# EAGLE design barebonesarduino (EAGLE 7.5.0)
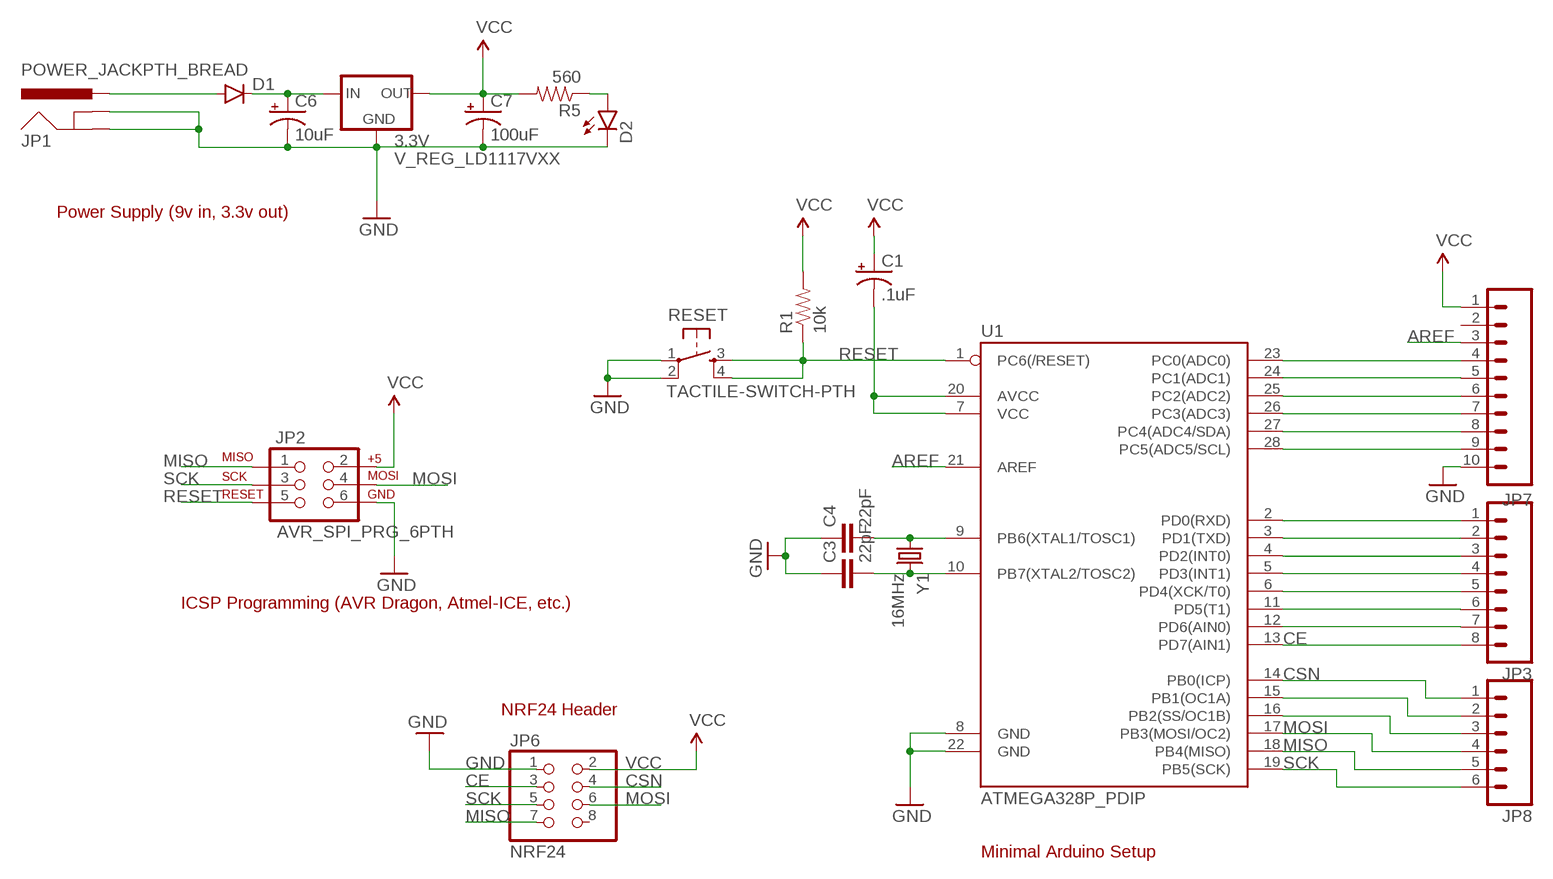
[diagram p0: schematic, sheet 1]

## Parts
3.3V  V_REG_LD1117VXX  [78XXL]
C1  .1uF  CAP_POLPTH1  [CPOL-RADIAL-100UF-25V]
C3  22pF  CAPPTH  [CAP-PTH-SMALL]
C4  22pF  CAPPTH  [CAP-PTH-SMALL]
C6  10uF  CAP_POLPTH1  [CPOL-RADIAL-100UF-25V]
C7  100uF  CAP_POLPTH1  [CPOL-RADIAL-100UF-25V]
D1  DIODEPTH  [DIODE-1N4001]
D2  LED5MM  [LED5MM]
JP1  POWER_JACKPTH_BREAD  [POWER_JACK_PTH_BREAD]
JP2  AVR_SPI_PRG_6PTH  [2X3]
JP3  M08NO_SILK_FEMALE_PTH  [1X08_NO_SILK]
JP6  NRF24  PINHD-2X4  [2X04]
JP7  M10NO_SILK_PTH_FEMALE  [1X10_NO_SILK]
JP8  M06NO_SILK_YES_STOP  [1X06_NO_SILK_YES_STOP]
R1  10k  RESISTORPTH-1/4W  [AXIAL-0.4]
R5  560  RESISTORPTH-1/4W  [AXIAL-0.4]
RESET  TACTILE-SWITCH-PTH  [TAC-SWITCH-PTH]
U1  ATMEGA328P_PDIP  [DIL28-3]
Y1  16MHz  CRYSTALHC49US  [HC49US]

## Nets
AREF: JP7.3 U1.21(AREF)
CE: JP3.8 JP6.3 U1.13(PD7(AIN1))
CSN: JP6.4 JP8.1 U1.14(PB0(ICP))
GND: 3.3V.IN(GND) C3.1 C4.1 C6.2(-) C7.2(-) D2.K(C) JP1.GND JP1.GNDBREAK JP2.6 JP6.1 JP7.10 RESET.1 RESET.2 U1.8(GND) U1.22(GND)
MISO: JP2.1 JP6.7 JP8.5 U1.18(PB4(MISO))
MOSI: JP2.4 JP6.6 JP8.4 U1.17(PB3(MOSI/OC2))
N$1: C4.2 U1.9(PB6(XTAL1/TOSC1)) Y1.1
N$2: JP7.4 U1.23(PC0(ADC0))
N$3: JP7.5 U1.24(PC1(ADC1))
N$4: JP7.6 U1.25(PC2(ADC2))
N$5: JP7.7 U1.26(PC3(ADC3))
N$6: JP7.8 U1.27(PC4(ADC4/SDA))
N$7: JP7.9 U1.28(PC5(ADC5/SCL))
N$8: C3.2 U1.10(PB7(XTAL2/TOSC2)) Y1.2
N$9: JP3.1 U1.2(PD0(RXD))
N$10: JP3.2 U1.3(PD1(TXD))
N$11: JP3.3 U1.4(PD2(INT0))
N$12: JP3.4 U1.5(PD3(INT1))
N$13: JP3.5 U1.6(PD4(XCK/T0))
N$14: JP3.6 U1.11(PD5(T1))
N$15: 3.3V.OUT(IN) C6.1(+) D1.C
N$16: D1.A JP1.PWR
N$17: D2.A R5.P$1
N$18: JP3.7 U1.12(PD6(AIN0))
N$19: C1.2(-) U1.7(VCC) U1.20(AVCC)
N$21: JP8.2 U1.15(PB1(OC1A))
N$22: JP8.3 U1.16(PB2(SS/OC1B))
RESET: JP2.5 R1.P$1 RESET.3 RESET.4 U1.1(PC6(/RESET))
SCK: JP2.3 JP6.5 JP8.6 U1.19(PB5(SCK))
VCC: 3.3V.GND(OUT) C1.1(+) C7.1(+) JP2.2 JP6.2 JP7.1 R1.P$2 R5.P$2
Unconnected: JP6.8 JP7.2

## Notes on the sheet
- Power Supply (9v in, 3.3v out)
- ICSP Programming (AVR Dragon, Atmel-ICE, etc.)
- NRF24 Header
- Minimal Arduino Setup

## Library data of the parts
3.3V = SparkFun-PowerIC:V_REG_LD1117VXX: LD1117VXX voltage regulator. We carry the 3.3V version (COM-00526) in TO-220 package.
C1 C6 C7 = SparkFun-Capacitors:CAP_POL: Capacitor Polarized These are standard SMD and PTH capacitors. Normally 10uF, 47uF, and 100uF in electrolytic and tantalum varieties. Always verify the external diameter of the through hole cap, it varies with capacity, voltage, and manufacturer. The EIA devices should be standard.
C3 C4 = SparkFun-Passives:CAP: Capacitor Standard 0603 ceramic capacitor, and 0.1" leaded capacitor.
D1 = SparkFun-DiscreteSemi:DIODE: Diode These are standard reverse protection diodes and small signal diodes. SMA package can handle up to about 1A. SOD-323 can handle about 200mA. What the SOD-323 package when ordering, there are some mfgs out there that are 5-pin packages.
D2 = SparkFun-LED:LED: LEDs Standard schematic elements and footprints for 5mm, 3mm, 1206, and 0603 sized LEDs. 5mm - Spark Fun Electronics SKU : COM-00529 (and others)
JP1 = SparkFun-Connectors:POWER_JACK: Power Jack This is the standard 5.5mm barrel jack for power. The PTH is the most common, proven, reliable, footprint. The Slot footprint only works if the mill layer is transmitted to the PCB fab house so be warned. Mating wall wart : TOL-00298 (and others); PROD_ID: PRT-10811
JP2 = SparkFun-Connectors:AVR_SPI_PRG_6: AVR ISP 6 Pin This is the reduced ISP connector for AVR programming. Common on Arduino. This footprint will take up less PCB space and can be used with a 10-pin to 6-pin adapter such as SKU: BOB-08508 **Special note about "TEST_POINT" package. The stop mask is on the top side, so if you want your programming test points to be on the bottom of your board, make sure to place this package on the bottom side of the board. This also ensure that the orientation to program from the bottom side will be correct.
JP3 = SparkFun-Connectors:M08: Header 8 Standard 8-pin 0.1" header. Use with straight break away headers (SKU : PRT-00116), right angle break away headers (PRT-00553), swiss pins (PRT-00743), machine pins (PRT-00117), and female headers (PRT-00115).; PROD_ID: CONN-08438
JP6 = pinhead:PINHD-2X4: PIN HEADER
JP7 = SparkFun-Connectors:M10: Header 10 Standard 10-pin 0.1" header. Use with straight break away headers (SKU : PRT-00116), right angle break away headers (PRT-00553), swiss pins (PRT-00743), machine pins (PRT-00117), and female headers (PRT-00115).; PROD_ID: CONN-11563
JP8 = SparkFun-Connectors:M06: Header 6 Standard 6-pin 0.1" header. Use with straight break away headers (SKU : PRT-00116), right angle break away headers (PRT-00553), swiss pins (PRT-00743), machine pins (PRT-00117), and female headers (PRT-00115). Molex polarized connector foot print use with SKU : PRT-08094 with associated crimp pins and housings. NOTES ON THE VARIANTS LOCK and LOCK_LONGPADS... This footprint was designed to help hold the alignment of a through-hole component (i.e. 6-pin header) while soldering it into place. You may notice that each hole has been shifted either up or down by 0.005 of an inch from it's more standard position (which is a perfectly straight line). This slight alteration caused the pins (the squares in the middle) to touch the edges of the holes. Because they are alternating, it causes a "brace" to hold the component in place. 0.005 has proven to be the perfect amount of "off-center" position when using our standard breakaway headers. Although looks a little odd when you look at the bare footprint, once you have a header in there, the alteration is very hard to notice. Also,if you push a header all the way into place, it is covered up entirely on the bottom side. This idea of altering the position of holes to aid alignment will be further integrated into the Sparkfun Library for other footprints. It can help hold any component with 3 or more connection pins.
R1 R5 = SparkFun-Resistors:RESISTOR: Resistor Basic schematic elements and footprints for 0603, 1206, and PTH resistors.
RESET = GeekAmmo:TACTILE-SWITCH: Tactile Switch 4 Pins, SPST NO
U1 = SparkFun-DigitalIC:ATMEGA328P_PDIP: uC used in the Arduino 32kb flash, 1k EEPROM, 2k SRAM This is the through-hole version of this chip.
Y1 = SparkFun-FreqCtrl:CRYSTAL: Various standard crystals. Proven footprints.

## Board
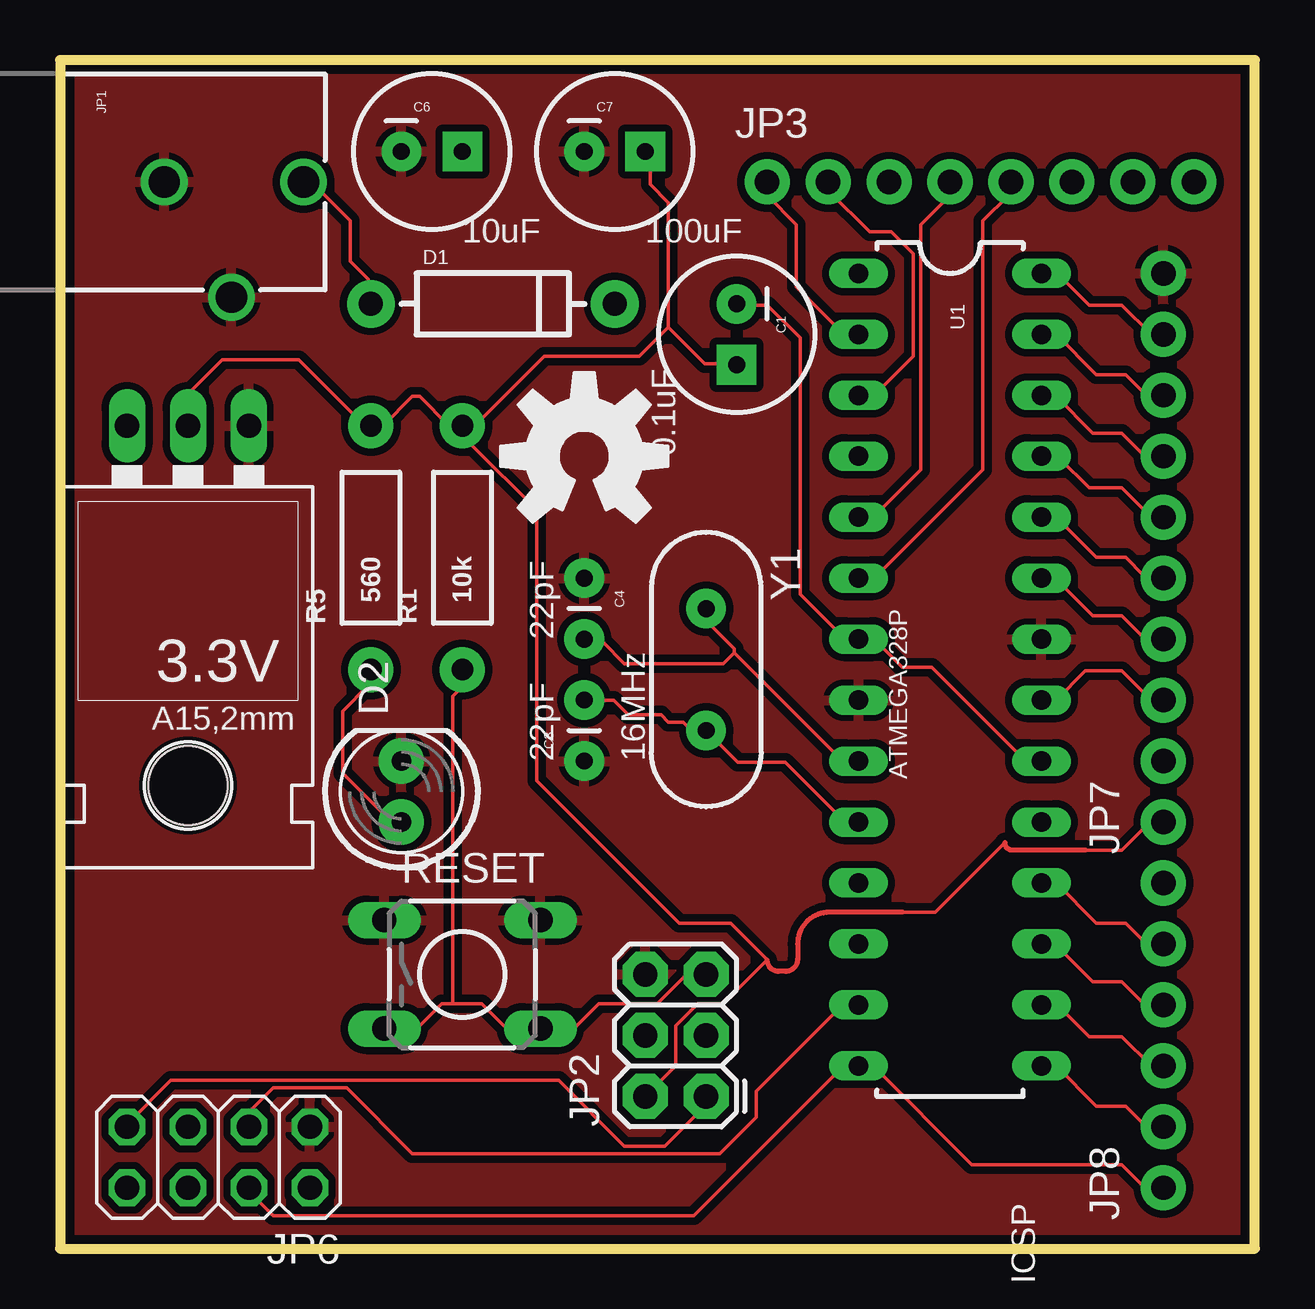
[diagram p1: board, top side]
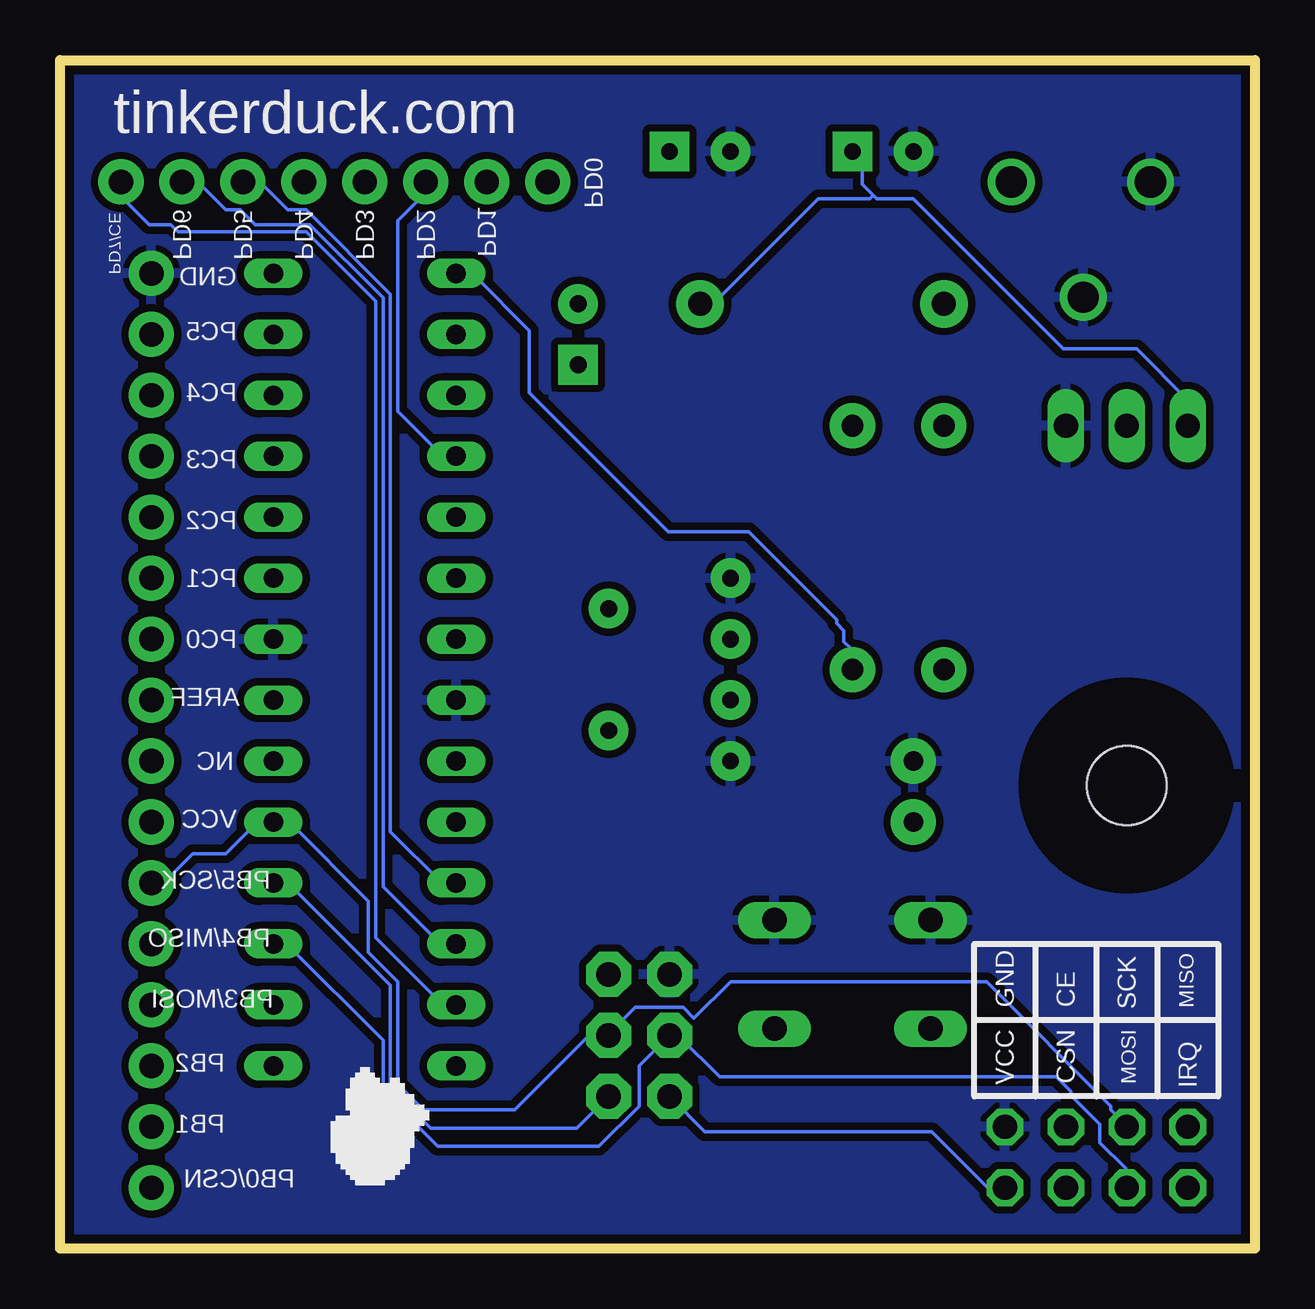
[diagram p2: board, bottom side, seen from below]

Size 49.78 x 49.53 mm. Coordinates in mm from the lower left corner, seen from the top.
Outline: 0,49.53 0,0 49.78,0 49.78,49.53 0,49.53
Copper layers (1*16): Top 0.0356mm / dielectric 1.5011mm / Bottom 0.0356mm
Design rules "LaenPCBOrder": minimum track width 6mil, minimum drill 13mil, track to track 6mil, track to pad 6mil, pad to pad 6mil, via to via 6mil, smd to smd 6mil, copper to edge 15mil, drill to drill 6mil, minimum pad ring 7mil, minimum via ring 7mil, stop-mask expansion 3mil, vias tented up to drill 0mil, thermal gap 10mil

### Footprints (pad centres in the part's own frame; a part is rotated, then mirrored left to right if it is on the bottom)
78XXL = drill 1.016 long: GND 0,-3.81; IN -2.54,-3.81; OUT 2.54,-3.81 | hole 3.302: 0,11.176
CPOL-RADIAL-100UF-25V = drill 0.7 pad 1.651 square: 1 1.27,0 | drill 0.7 pad 1.651: 2 -1.27,0
CAP-PTH-SMALL = drill 0.7 pad 1.651: 1 0,0; 2 2.54,0
DIODE-1N4001 = drill 1 pad 1.981: A -5.08,0; C 5.08,0
LED5MM = drill 0.813 pad 1.88: A -1.27,0; K 1.27,0
POWER_JACK_PTH_BREAD = drill 1.3: GND 0,7.9; GNDBREAK 4.8,10.7; PWR 0,13.7
2X3 = drill 1.016 pad 1.88 octagon: 1 0,0; 2 0,2.54; 3 2.54,0; 4 2.54,2.54; 5 5.08,0; 6 5.08,2.54
1X08_NO_SILK = drill 1.016 pad 1.88: 1 0,0; 2 2.54,0; 3 5.08,0; 4 7.62,0; 5 10.16,0; 6 12.7,0; 7 15.24,0; 8 17.78,0
2X04 = drill 1.016 octagon: 1 -3.81,-1.27; 2 -3.81,1.27; 3 -1.27,-1.27; 4 -1.27,1.27; 5 1.27,-1.27; 6 1.27,1.27; 7 3.81,-1.27; 8 3.81,1.27
1X10_NO_SILK = drill 1.016 pad 1.88: 1 0,0; 2 2.54,0; 3 5.08,0; 4 7.62,0; 5 10.16,0; 6 12.7,0; 7 15.24,0; 8 17.78,0; 9 20.32,0; 10 22.86,0
1X06_NO_SILK_YES_STOP = drill 1.016 pad 1.88: 1 0,0; 2 2.54,0; 3 5.08,0; 4 7.62,0; 5 10.16,0; 6 12.7,0
AXIAL-0.4 = drill 0.9 pad 1.88: P$1 -5.08,0; P$2 5.08,0
TAC-SWITCH-PTH = drill 1.016 pad 1.524 long: 1 -3.251,2.261; 2 3.251,2.261; 3 -3.251,-2.261; 4 3.251,-2.261
DIL28-3 = drill 0.813 long: 1 -16.51,-3.81; 2 -13.97,-3.81; 3 -11.43,-3.81; 4 -8.89,-3.81; 5 -6.35,-3.81; 6 -3.81,-3.81; 7 -1.27,-3.81; 8 1.27,-3.81; 9 3.81,-3.81; 10 6.35,-3.81; 11 8.89,-3.81; 12 11.43,-3.81; 13 13.97,-3.81; 14 16.51,-3.81; 15 16.51,3.81; 16 13.97,3.81; 17 11.43,3.81; 18 8.89,3.81; 19 6.35,3.81; 20 3.81,3.81; 21 1.27,3.81; 22 -1.27,3.81; 23 -3.81,3.81; 24 -6.35,3.81; 25 -8.89,3.81; 26 -11.43,3.81; 27 -13.97,3.81; 28 -16.51,3.81
HC49US = drill 0.7 pad 1.651: 1 -2.54,0; 2 2.54,0

### Placement (x,y rotation side)
3.3V  5.33,30.48 180 top
C1  28.19,38.1 270 top
C3  21.84,20.32 90 top
C4  21.84,27.94 270 top
C6  15.49,45.72 0 top
C7  23.11,45.72 0 top
D1  18.03,39.37 0 top
D2  14.22,19.05 90 top
JP1  -3.56,44.45 270 top
JP2  26.92,6.35 90 top
JP3  29.46,44.45 0 top
JP6  6.6,3.81 180 top
JP7  45.97,17.78 90 top
JP8  45.97,2.54 90 top
R1  16.76,29.21 90 top
R5  12.95,29.21 90 top
RESET  16.76,11.43 0 top
U1  37.08,24.13 270 top
U$1  [OSHW-LOGO-L]  21.84,33.02 0 top
Y1  26.92,24.13 270 top

### Tracks (layer width: path | path; a pad name or v marks a point on that pad's centre or on a via)
AREF
  Top 0.152: U1.21 41.5,22.86 42.72,24.08 44.25,24.08 45.47,22.86 JP7.3
CE
  Top 0.152: U1.13 33.27,10.06 32.51,10.06 29.01,6.55 29.01,5.49 27.48,3.96 14.68,3.96 11.94,6.71 8.89,6.71 7.98,5.79 7.98,5.18 JP6.3
  Bottom 0.152: JP3.8 47.14,44.35 47.14,43.74 46.08,42.67 45.16,42.67 44.86,42.37 39.52,42.37 36.63,39.47 36.63,12.95 33.88,10.21 33.27,10.21 U1.13
CSN
  Top 0.152: JP8.1 45.92,2.59 45.16,2.59 44.25,3.5 38,3.5 33.88,7.62 U1.14 32.66,7.62 26.42,1.37 8.89,1.37 8.28,1.98 8.28,2.13 JP6.4
GND
  pour Top (isolate 0.305): 0.25,49.53 49.78,49.53 49.78,0 0.25,0
  pour Bottom (isolate 0.305): 0.25,49.53 0.25,0 49.78,0 49.78,49.53
MISO
  Top 0.152: U1.18 41.5,15.24 43.18,13.56 44.4,13.56 45.16,12.8 45.92,12.8 JP8.5 | JP6.7 2.79,5.18 4.62,7.01 20.78,7.01 23.52,4.27 25.2,4.27 26.87,5.94 26.87,6.25 JP2.1
  Bottom 0.152: U1.18 40.28,15.24 36.02,10.97 36.02,6.71 34.34,5.03 28.25,5.03 JP2.1
MOSI
  Top 0.152: U1.17 40.89,12.65 41.5,12.65 43.03,11.12 44.25,11.12 45.16,10.21 45.92,10.21 JP8.4
  Bottom 0.152: JP6.6 5.39,2.59 5.39,3.35 6.45,4.42 6.45,5.18 7.67,6.4 7.67,6.55 8.28,7.16 22.3,7.16 23.98,8.84 24.28,8.84 JP2.4 25.65,7.62 25.65,5.94 27.33,4.27 34.04,4.27 36.32,6.55 36.32,8.69 40.28,12.65 40.89,12.65 U1.17
N$1
  Top 0.152: 28.09,24.84 32.51,20.42 33.27,20.42 U1.9 | 28.09,24.84 28.09,24.99 27.03,26.06 27.03,26.67 Y1.1 | 28.09,24.84 27.64,24.38 23.52,24.38 22.61,25.3 21.84,25.3 C4.2
N$2
  Top 0.152: U1.23 40.89,27.89 41.5,27.89 43.03,26.36 44.25,26.36 45.16,25.45 45.92,25.45 JP7.4
N$3
  Top 0.152: U1.24 41.5,30.48 43.18,28.8 44.4,28.8 45.16,28.04 45.92,28.04 JP7.5
N$4
  Top 0.152: JP7.6 45.47,30.48 44.25,31.7 42.88,31.7 41.66,32.92 40.89,32.92 U1.25
N$5
  Top 0.152: U1.26 40.89,35.51 41.5,35.51 43.03,33.98 44.25,33.98 45.16,33.07 45.92,33.07 JP7.7
N$6
  Top 0.152: U1.27 41.5,38.1 43.18,36.42 44.4,36.42 45.16,35.66 45.92,35.66 JP7.8
N$7
  Top 0.152: JP7.9 45.47,38.1 44.25,39.32 42.88,39.32 41.66,40.54 40.89,40.54 U1.28
N$8
  Top 0.152: U1.10 33.27,17.83 32.66,17.83 30.23,20.27 28.25,20.27 Y1.2 26.87,21.64 26.26,21.64 25.96,21.95 25.35,21.95 25.04,22.25 23.67,22.25 23.06,22.86 C3.2
N$9
  Top 0.152: U1.2 32.66,38.1 30.68,40.08 30.68,42.67 29.46,43.89 JP3.1
N$10
  Top 0.152: U1.3 33.27,35.66 34.04,35.66 35.56,37.19 35.56,41.45 34.65,42.37 33.73,42.37 32.06,44.04 32.06,44.35 JP3.2
N$11
  Bottom 0.152: U1.4 33.27,33.07 33.88,33.07 35.71,34.9 35.71,42.82 34.65,43.89 34.65,44.35 JP3.3
N$12
  Top 0.152: U1.5 33.88,30.48 35.86,32.46 35.86,42.67 37.08,43.89 JP3.4
N$13
  Top 0.152: U1.6 33.27,28.04 34.04,28.04 38.46,32.46 38.46,42.82 39.52,43.89 39.52,44.35 JP3.5
N$14
  Bottom 0.152: U1.11 33.88,15.24 36.02,17.37 36.02,39.78 39.52,43.28 40.28,43.28 41.35,44.35 42.11,44.35 JP3.6
N$15
  Bottom 0.152: 3.3V.OUT 2.79,35.36 4.93,37.49 7.98,37.49 14.22,43.74 15.75,43.74 15.9,43.89 | 15.9,43.89 16.36,44.35 16.36,45.42 16.66,45.72 C6.1 | 15.9,43.89 16.05,43.74 18.19,43.74 22.45,39.47 23.06,39.47 D1.C
N$16
  Top 0.152: JP1.PWR 10.26,44.35 10.57,44.35 12.09,42.82 12.09,41.15 12.85,40.39 12.85,39.47 D1.A
N$17
  Top 0.152: R5.P$1 12.85,24.08 12.85,23.47 11.79,22.4 11.79,19.81 13.77,17.83 14.22,17.83 D2.A
N$18
  Bottom 0.152: U1.12 33.27,12.8 34.04,12.8 36.32,15.09 36.32,39.62 39.37,42.67 41.66,42.67 42.27,43.28 42.88,43.28 43.94,44.35 44.7,44.35 JP3.7
N$19
  Top 0.152: U1.20 40.89,20.42 40.13,20.42 36.32,24.23 35.1,24.23 34.04,25.3 33.27,25.3 U1.7 33.27,25.45 32.66,25.45 30.84,27.28 30.84,37.95 29.46,39.32 28.25,39.32 C1.2
N$21
  Top 0.152: U1.15 41.5,7.62 43.18,5.94 44.4,5.94 45.16,5.18 45.92,5.18 JP8.2
N$22
  Top 0.152: JP8.3 45.47,7.62 44.25,8.84 42.88,8.84 41.66,10.06 40.89,10.06 U1.16
RESET
  Top 0.152: 16.36,10.21 17.58,10.21 18.49,9.3 20.02,9.3 | 16.36,10.21 15.9,10.21 14.99,9.3 13.61,9.3 RESET.3 | JP2.5 26.11,11.43 24.89,10.21 22.45,10.21 21.54,9.3 20.02,9.3 | 20.02,9.3 RESET.4 | 16.36,10.21 16.36,23.01 16.66,23.32 16.66,24.08 R1.P$1
  Bottom 0.152: U1.1 33.27,40.54 32.51,40.54 30.23,38.25 30.23,35.66 24.43,29.87 21.08,29.87 17.42,26.21 17.42,26.06 17.12,25.76 17.12,25.3 16.82,24.99 16.82,24.23 R1.P$1
SCK
  Bottom 0.152: 40.89,17.68 41.66,17.68 42.88,16.46 44.25,16.46 45.47,15.24 JP8.6 | JP6.5 5.39,5.18 5.99,5.79 5.99,5.94 11.18,11.12 21.84,11.12 23.37,9.6 23.82,10.06 25.81,10.06 26.87,8.99 JP2.3 27.03,8.84 27.79,8.84 30.84,5.79 34.65,5.79 35.71,6.86 35.71,11.12 36.93,12.34 36.93,14.48 40.13,17.68 40.89,17.68 | 40.89,17.68 U1.19
VCC
  Top 0.152: 3.3V.GND 5.39,34.29 5.39,35.66 6.76,37.03 9.96,37.03 12.7,34.29 R5.P$2 13.46,34.29 14.68,35.51 14.99,35.51 16.21,34.29 R1.P$2 | 25.35,38.41 26.87,36.88 28.09,36.88 C1.1 | 25.35,38.41 25.35,43.59 24.59,44.35 24.59,45.57 24.43,45.72 C7.1 | 17.12,34.29 17.27,34.29 20.17,37.19 24.13,37.19 25.35,38.41 | 17.12,34.29 R1.P$2 | 42.72,16.61 44.25,16.61 45.31,17.68 45.92,17.68 JP7.1 | 39.37,16.92 36.47,14.02 35.1,14.02 | JP2.2 25.65,7.62 25.65,9.3 26.57,10.21 27.64,10.21 29.46,12.04 27.94,13.56 25.81,13.56 19.86,19.51 19.86,30.79 17.12,33.53 17.12,34.29 | 16.82,34.29 R1.P$2
  Top 0.213: 35.1,14.02 32.06,14.02 arc90 30.73,12.7 30.73,12.06 arc-90 30.23,11.56 29.95,11.56 arc-90 29.46,12.04 | 42.72,16.61 39.67,16.61 arc-90 39.37,16.92
  Bottom 0.152: JP2.2 22.91,4.88 13.46,4.88 11.18,2.59 10.41,2.59 JP6.2

### Text on the board
tPlace: 10uF | 100uF | 0.1uF | ATMEGA328P | 22pF | 22pF | 16MHz | ICSP
bPlace: tinkerduck.com | PD0 | PD1 | PD2 | PD3 | PD4 | PD5 | PD6 | PD7/CE | GND | PC5 | PC4 | PC3 | PC2 | PC1 | PC0 | AREF | NC | VCC | PB5/SCK | PB4/MISO | MISO | SCK | CE | GND | PB3/MOSI | IRQ | MOSI | CSN | VCC | PB2 | PB1 | PB0/CSN